# EAGLE design T2M_4_0 (EAGLE 9.5.2)

## Sheet 1 of 2
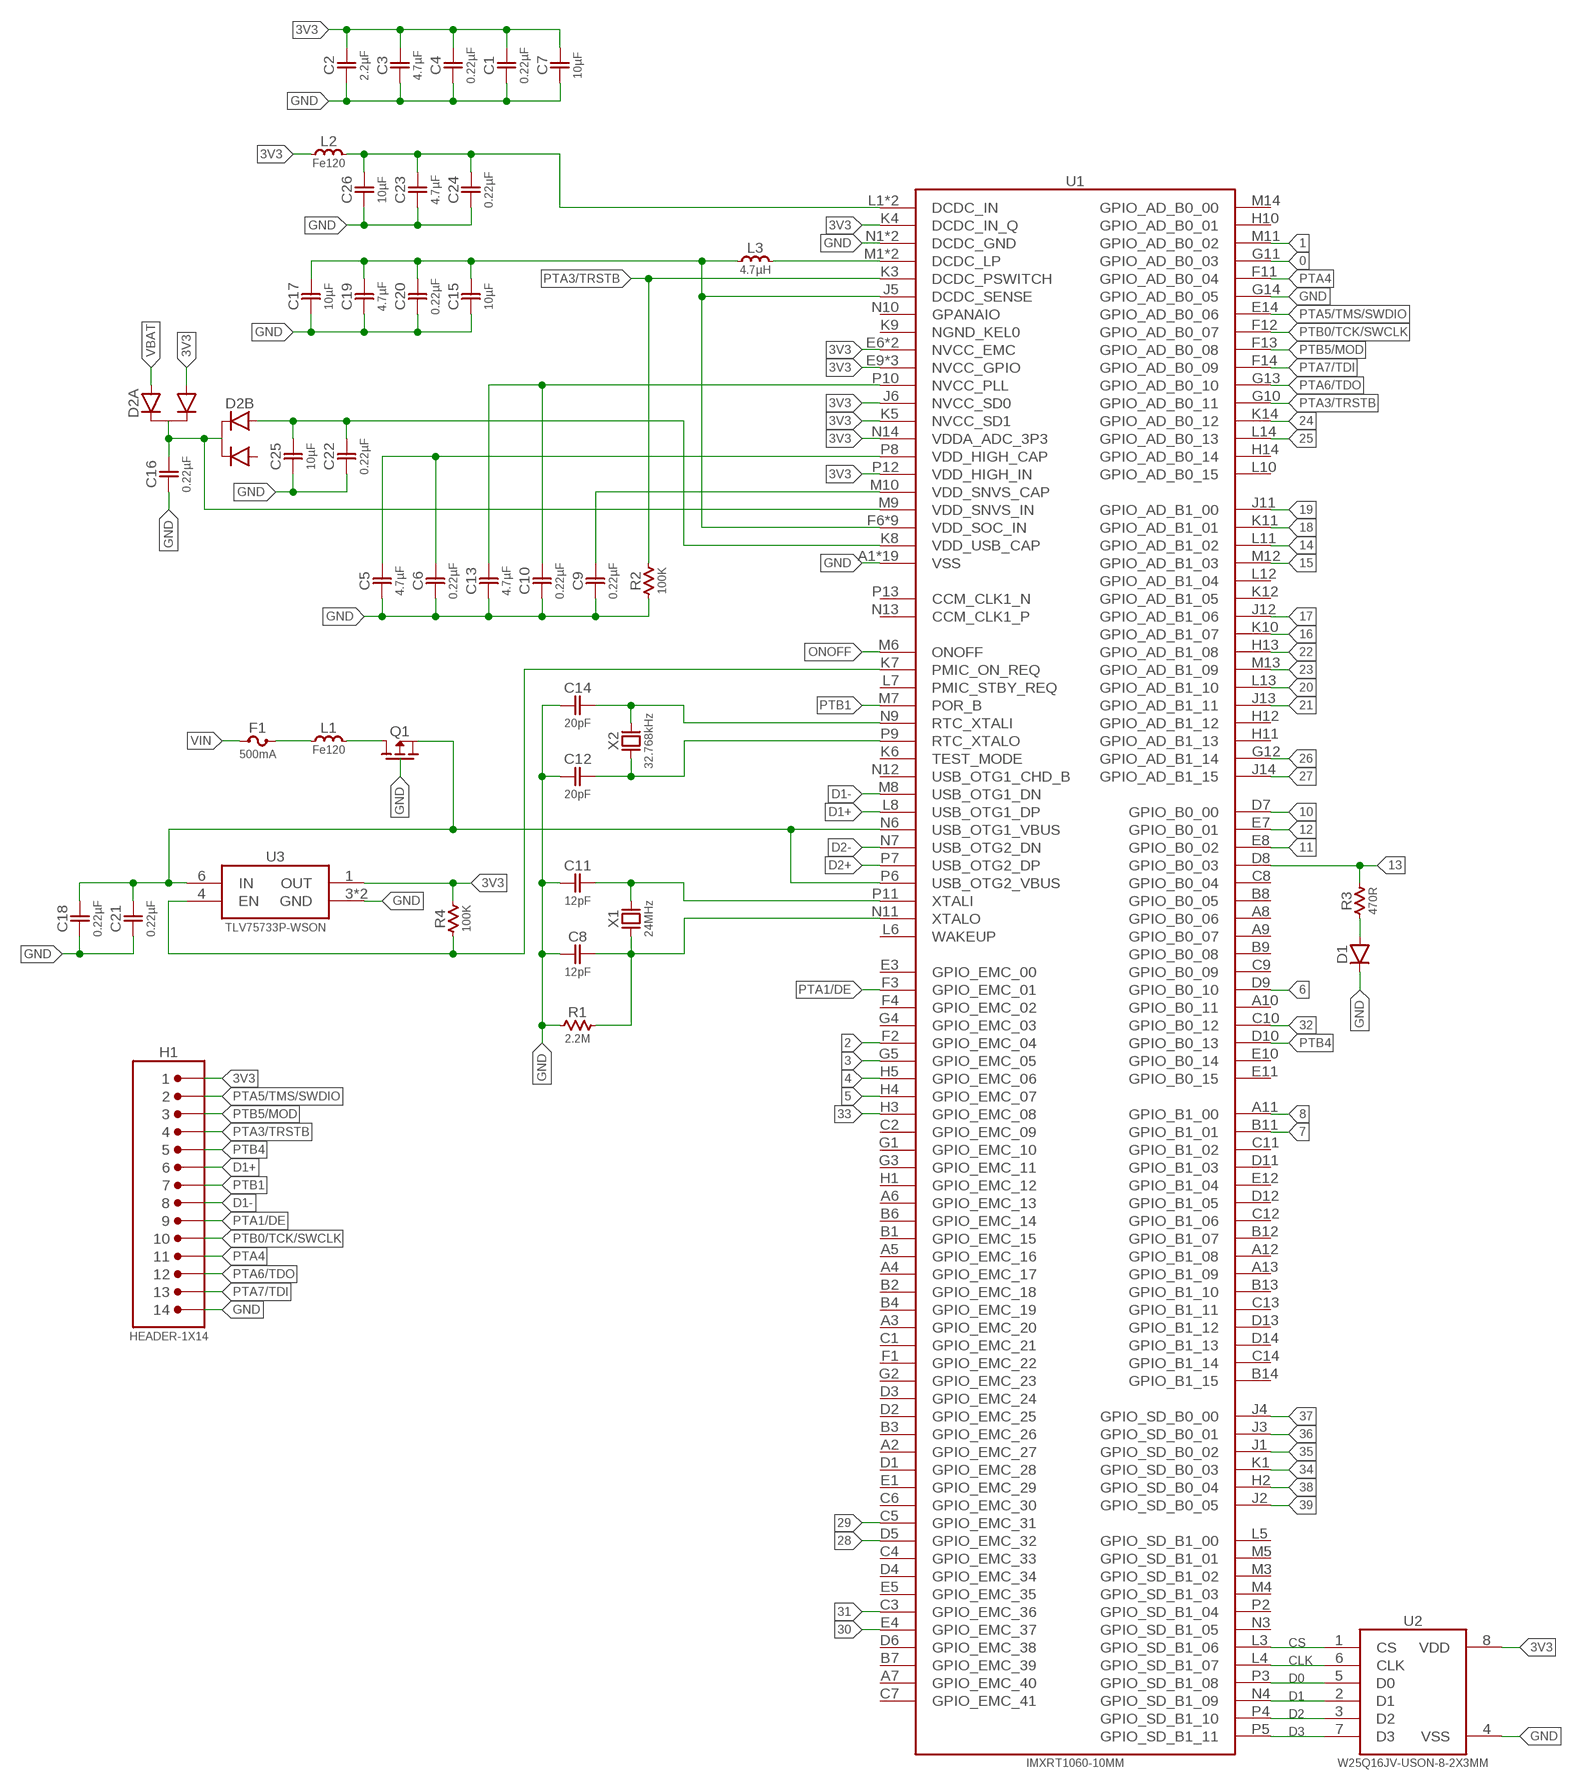
[diagram p0: schematic, sheet 1]

### Parts
C1  0.22µF  CAP-NP-0402  [0402-NP]
C2  2.2µF  CAP-NP-0402  [0402-NP]
C3  4.7µF  CAP-NP-0402  [0402-NP]
C4  0.22µF  CAP-NP-0402  [0402-NP]
C5  4.7µF  CAP-NP-0402  [0402-NP]
C6  0.22µF  CAP-NP-0402  [0402-NP]
C7  10µF  CAP-NP-0603  [0603-NP]
C8  12pF  CAP-NP-0402  [0402-NP]
C9  0.22µF  CAP-NP-0402  [0402-NP]
C10  0.22µF  CAP-NP-0402  [0402-NP]
C11  12pF  CAP-NP-0402  [0402-NP]
C12  20pF  CAP-NP-0402  [0402-NP]
C13  4.7µF  CAP-NP-0402  [0402-NP]
C14  20pF  CAP-NP-0402  [0402-NP]
C15  10µF  CAP-NP-0603  [0603-NP]
C16  0.22µF  CAP-NP-0402  [0402-NP]
C17  10µF  CAP-NP-0603  [0603-NP]
C18  0.22µF  CAP-NP-0402  [0402-NP]
C19  4.7µF  CAP-NP-0402  [0402-NP]
C20  0.22µF  CAP-NP-0402  [0402-NP]
C21  0.22µF  CAP-NP-0402  [0402-NP]
C22  0.22µF  CAP-NP-0402  [0402-NP]
C23  4.7µF  CAP-NP-0402  [0402-NP]
C24  0.22µF  CAP-NP-0402  [0402-NP]
C25  10µF  CAP-NP-0603  [0603-NP]
C26  10µF  CAP-NP-0603  [0603-NP]
D1  DIODE-0402  [0402-P]
D2  BAT54C-2-SOT-666  [SOT-666]
F1  500mA  FUSE-0603  [0603-NP]
H1  HEADER-1X14  [2X7-1.27MM]
L1  Fe120  INDUCTOR-0402  [0402-NP]
L2  Fe120  INDUCTOR-0402  [0402-NP]
L3  4.7µH  INDUCTOR-0603  [0603-NP]
Q1  MOSFET-P  [SOT-23]
R1  2.2M  RESISTOR-0402  [0402-NP]
R2  100K  RESISTOR-0402  [0402-NP]
R3  470R  RESISTOR-0402  [0402-NP]
R4  100K  RESISTOR-0402  [0402-NP]
U1  IMXRT1060-10MM  [BGA-196-10MM]
U2  W25Q16JV-USON-8-2X3MM  [USON-8-2X3MM]
U3  TLV75733P-WSON  [WSON-6]
X1  24MHz  CRYSTAL-2X1.6MM  [CRYSTAL-2X1.6MM]
X2  32.768kHz  CRYSTAL-2X1.2MM  [CRYSTAL-2X1.2MM]

### Nets
0: U1.G11(GPIO_AD_B0_03) ; also sheet 2
1: U1.M11(GPIO_AD_B0_02) ; also sheet 2
2: U1.F2(GPIO_EMC_04) ; also sheet 2
3: U1.G5(GPIO_EMC_05) ; also sheet 2
3V3: C1.2 C2.2 C3.2 C4.2 C7.2 D2.2(A:A2) H1.1 L2.1 R4.2 U1.E6(NVCC_EMC) U1.E9(NVCC_GPIO) U1.F5(NVCC_EMC) U1.F10(NVCC_GPIO) U1.J6(NVCC_SD0) U1.J10(NVCC_GPIO) U1.K4(DCDC_IN_Q) U1.K5(NVCC_SD1) U1.N14(VDDA_ADC_3P3) U1.P12(VDD_HIGH_IN) U2.8(VDD) U3.1(OUT) ; also sheet 2
4: U1.H5(GPIO_EMC_06) ; also sheet 2
5: U1.H4(GPIO_EMC_07) ; also sheet 2
6: U1.D9(GPIO_B0_10) ; also sheet 2
7: U1.B11(GPIO_B1_01) ; also sheet 2
8: U1.A11(GPIO_B1_00) ; also sheet 2
10: U1.D7(GPIO_B0_00) ; also sheet 2
11: U1.E8(GPIO_B0_02) ; also sheet 2
12: U1.E7(GPIO_B0_01) ; also sheet 2
13: R3.2 U1.D8(GPIO_B0_03) ; also sheet 2
14: U1.L11(GPIO_AD_B1_02) ; also sheet 2
15: U1.M12(GPIO_AD_B1_03) ; also sheet 2
16: U1.K10(GPIO_AD_B1_07) ; also sheet 2
17: U1.J12(GPIO_AD_B1_06) ; also sheet 2
18: U1.K11(GPIO_AD_B1_01) ; also sheet 2
19: U1.J11(GPIO_AD_B1_00) ; also sheet 2
20: U1.L13(GPIO_AD_B1_10) ; also sheet 2
21: U1.J13(GPIO_AD_B1_11) ; also sheet 2
22: U1.H13(GPIO_AD_B1_08) ; also sheet 2
23: U1.M13(GPIO_AD_B1_09) ; also sheet 2
24: U1.K14(GPIO_AD_B0_12) ; also sheet 2
25: U1.L14(GPIO_AD_B0_13) ; also sheet 2
26: U1.G12(GPIO_AD_B1_14) ; also sheet 2
27: U1.J14(GPIO_AD_B1_15) ; also sheet 2
28: U1.D5(GPIO_EMC_32) ; also sheet 2
29: U1.C5(GPIO_EMC_31) ; also sheet 2
30: U1.E4(GPIO_EMC_37) ; also sheet 2
31: U1.C3(GPIO_EMC_36) ; also sheet 2
32: U1.C10(GPIO_B0_12) ; also sheet 2
33: U1.H3(GPIO_EMC_08) ; also sheet 2
34: U1.K1(GPIO_SD_B0_03) ; also sheet 2
35: U1.J1(GPIO_SD_B0_02) ; also sheet 2
36: U1.J3(GPIO_SD_B0_01) ; also sheet 2
37: U1.J4(GPIO_SD_B0_00) ; also sheet 2
38: U1.H2(GPIO_SD_B0_04) ; also sheet 2
39: U1.J2(GPIO_SD_B0_05) ; also sheet 2
CLK: U1.L4(GPIO_SD_B1_07) U2.6(CLK)
CS: U1.L3(GPIO_SD_B1_06) U2.1(CS)
D0: U1.P3(GPIO_SD_B1_08) U2.5(D0)
D1: U1.N4(GPIO_SD_B1_09) U2.2(D1)
D1+: H1.6 U1.L8(USB_OTG1_DP) ; also sheet 2
D1-: H1.8 U1.M8(USB_OTG1_DN) ; also sheet 2
D2: U1.P4(GPIO_SD_B1_10) U2.3(D2)
D2+: U1.P7(USB_OTG2_DP) ; also sheet 2
D2-: U1.N7(USB_OTG2_DN) ; also sheet 2
D3: U1.P5(GPIO_SD_B1_11) U2.7(D3)
GND: C1.1 C2.1 C3.1 C4.1 C5.1 C6.1 C7.1 C8.1 C9.1 C10.1 C11.1 C12.1 C13.1 C14.1 C15.1 C16.1 C17.1 C18.1 C19.1 C20.1 C21.1 C22.1 C23.1 C24.1 C25.1 C26.1 D1.C H1.14 Q1.1(G) R1.1 R2.1 U1.A1(VSS) U1.A14(VSS) U1.B5(VSS) U1.B10(VSS) U1.E2(VSS) U1.E13(VSS) U1.G7(VSS) U1.G8(VSS) U1.G14(GPIO_AD_B0_05) U1.H7(VSS) U1.H8(VSS) U1.J7(VSS) U1.J8(VSS) U1.K2(VSS) U1.K13(VSS) U1.L9(VSS) U1.N1(DCDC_GND) U1.N2(DCDC_GND) U1.N5(VSS) U1.N8(VSS) U1.P1(VSS) U1.P14(VSS) U2.4(VSS) U3.3(GND) U3.7(GND) ; also sheet 2
N$1: C11.2 U1.P11(XTALI) X1.3
N$2: C8.2 R1.2 U1.N11(XTALO) X1.1
N$3: C14.2 U1.N9(RTC_XTALI) X2.2
N$4: C12.2 U1.P9(RTC_XTALO) X2.1
N$5: D1.A R3.1
N$6: C18.2 C21.2 Q1.2(S) U1.N6(USB_OTG1_VBUS) U1.P6(USB_OTG2_VBUS) U3.6(IN)
N$7: R4.1 U1.K7(PMIC_ON_REQ) U3.4(EN)
N$8: C22.2 C25.2 D2.4(B:A1) U1.K8(VDD_USB_CAP)
N$10: L3.2 U1.M1(DCDC_LP) U1.M2(DCDC_LP)
N$11: C23.2 C24.2 C26.2 L2.2 U1.L1(DCDC_IN) U1.L2(DCDC_IN)
N$12: C15.2 C17.2 C19.2 C20.2 L3.1 U1.F6(VDD_SOC_IN) U1.F7(VDD_SOC_IN) U1.F8(VDD_SOC_IN) U1.F9(VDD_SOC_IN) U1.G6(VDD_SOC_IN) U1.G9(VDD_SOC_IN) U1.H6(VDD_SOC_IN) U1.H9(VDD_SOC_IN) U1.J5(DCDC_SENSE) U1.J9(VDD_SOC_IN)
N$14: C16.2 D2.3(B:CC) D2.6(A:CC) U1.M9(VDD_SNVS_IN)
N$15: L1.2 Q1.3(D)
N$16: F1.2 L1.1
N$32: C5.2 C6.2 U1.P8(VDD_HIGH_CAP)
N$33: C10.2 C13.2 U1.P10(NVCC_PLL)
N$34: C9.2 U1.M10(VDD_SNVS_CAP)
ONOFF: U1.M6(ONOFF) ; also sheet 2
PTA1/DE: H1.9 U1.F3(GPIO_EMC_01) ; also sheet 2
PTA3/TRSTB: H1.4 R2.2 U1.G10(GPIO_AD_B0_11) U1.K3(DCDC_PSWITCH) ; also sheet 2
PTA4: H1.11 U1.F11(GPIO_AD_B0_04) ; also sheet 2
PTA5/TMS/SWDIO: H1.2 U1.E14(GPIO_AD_B0_06) ; also sheet 2
PTA6/TDO: H1.12 U1.G13(GPIO_AD_B0_10) ; also sheet 2
PTA7/TDI: H1.13 U1.F14(GPIO_AD_B0_09) ; also sheet 2
PTB0/TCK/SWCLK: H1.10 U1.F12(GPIO_AD_B0_07) ; also sheet 2
PTB1: H1.7 U1.M7(POR_B) ; also sheet 2
PTB4: H1.5 U1.D10(GPIO_B0_13) ; also sheet 2
PTB5/MOD: H1.3 U1.F13(GPIO_AD_B0_08) ; also sheet 2
VBAT: D2.1(A:A1) ; also sheet 2
VIN: F1.1 ; also sheet 2
Unconnected: D2.5(B:A2) U1.A2(GPIO_EMC_27) U1.A3(GPIO_EMC_20) U1.A4(GPIO_EMC_17) U1.A5(GPIO_EMC_16) U1.A6(GPIO_EMC_13) U1.A7(GPIO_EMC_40) U1.A8(GPIO_B0_06) U1.A9(GPIO_B0_07) U1.A10(GPIO_B0_11) U1.A12(GPIO_B1_08) U1.A13(GPIO_B1_09) U1.B1(GPIO_EMC_15) U1.B2(GPIO_EMC_18) U1.B3(GPIO_EMC_26) U1.B4(GPIO_EMC_19) U1.B6(GPIO_EMC_14) U1.B7(GPIO_EMC_39) U1.B8(GPIO_B0_05) U1.B9(GPIO_B0_08) U1.B12(GPIO_B1_07) U1.B13(GPIO_B1_10) U1.B14(GPIO_B1_15) U1.C1(GPIO_EMC_21) U1.C2(GPIO_EMC_09) U1.C4(GPIO_EMC_33) U1.C6(GPIO_EMC_30) U1.C7(GPIO_EMC_41) U1.C8(GPIO_B0_04) U1.C9(GPIO_B0_09) U1.C11(GPIO_B1_02) U1.C12(GPIO_B1_06) U1.C13(GPIO_B1_11) U1.C14(GPIO_B1_14) U1.D1(GPIO_EMC_28) U1.D2(GPIO_EMC_25) U1.D3(GPIO_EMC_24) U1.D4(GPIO_EMC_34) U1.D6(GPIO_EMC_38) U1.D11(GPIO_B1_03) U1.D12(GPIO_B1_05) U1.D13(GPIO_B1_12) U1.D14(GPIO_B1_13) U1.E1(GPIO_EMC_29) U1.E3(GPIO_EMC_00) U1.E5(GPIO_EMC_35) U1.E10(GPIO_B0_14) U1.E11(GPIO_B0_15) U1.E12(GPIO_B1_04) U1.F1(GPIO_EMC_22) U1.F4(GPIO_EMC_02) U1.G1(GPIO_EMC_10) U1.G2(GPIO_EMC_23) U1.G3(GPIO_EMC_11) U1.G4(GPIO_EMC_03) U1.H1(GPIO_EMC_12) U1.H10(GPIO_AD_B0_01) U1.H11(GPIO_AD_B1_13) U1.H12(GPIO_AD_B1_12) U1.H14(GPIO_AD_B0_14) U1.K6(TEST_MODE) U1.K9(NGND_KEL0) U1.K12(GPIO_AD_B1_05) U1.L5(GPIO_SD_B1_00) U1.L6(WAKEUP) U1.L7(PMIC_STBY_REQ) U1.L10(GPIO_AD_B0_15) U1.L12(GPIO_AD_B1_04) U1.M3(GPIO_SD_B1_02) U1.M4(GPIO_SD_B1_03) U1.M5(GPIO_SD_B1_01) U1.M14(GPIO_AD_B0_00) U1.N3(GPIO_SD_B1_05) U1.N10(GPANAIO) U1.N12(USB_OTG1_CHD_B) U1.N13(CCM_CLK1_P) U1.P2(GPIO_SD_B1_04) U1.P13(CCM_CLK1_N)

## Sheet 2 of 2
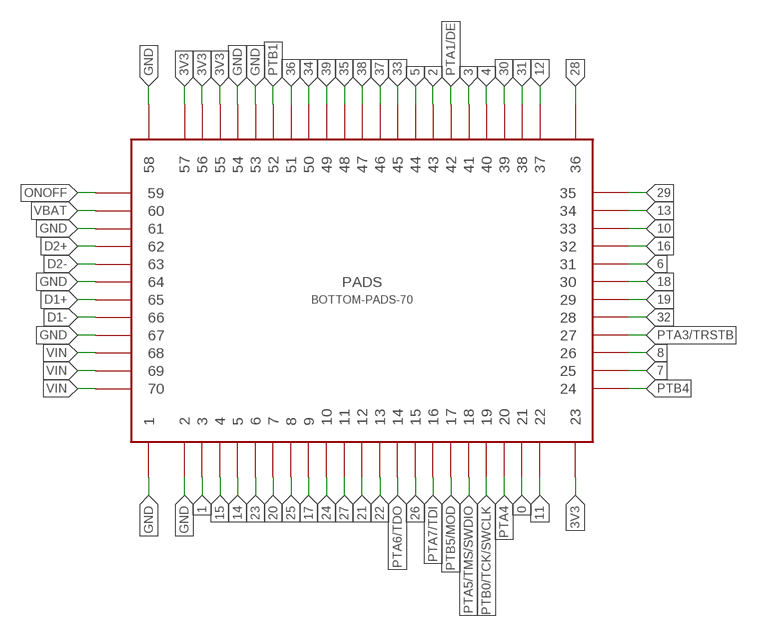
[diagram p1: schematic, sheet 2]

### Parts
PADS  BOTTOM-PADS-70  [BOTTOM-PADS-70]

### Nets
0: PADS.21 ; also sheet 1
1: PADS.3 ; also sheet 1
2: PADS.43 ; also sheet 1
3: PADS.41 ; also sheet 1
3V3: PADS.23 PADS.55 PADS.56 PADS.57 ; also sheet 1
4: PADS.40 ; also sheet 1
5: PADS.44 ; also sheet 1
6: PADS.31 ; also sheet 1
7: PADS.25 ; also sheet 1
8: PADS.26 ; also sheet 1
10: PADS.33 ; also sheet 1
11: PADS.22 ; also sheet 1
12: PADS.37 ; also sheet 1
13: PADS.34 ; also sheet 1
14: PADS.5 ; also sheet 1
15: PADS.4 ; also sheet 1
16: PADS.32 ; also sheet 1
17: PADS.9 ; also sheet 1
18: PADS.30 ; also sheet 1
19: PADS.29 ; also sheet 1
20: PADS.7 ; also sheet 1
21: PADS.12 ; also sheet 1
22: PADS.13 ; also sheet 1
23: PADS.6 ; also sheet 1
24: PADS.10 ; also sheet 1
25: PADS.8 ; also sheet 1
26: PADS.15 ; also sheet 1
27: PADS.11 ; also sheet 1
28: PADS.36 ; also sheet 1
29: PADS.35 ; also sheet 1
30: PADS.39 ; also sheet 1
31: PADS.38 ; also sheet 1
32: PADS.28 ; also sheet 1
33: PADS.45 ; also sheet 1
34: PADS.50 ; also sheet 1
35: PADS.48 ; also sheet 1
36: PADS.51 ; also sheet 1
37: PADS.46 ; also sheet 1
38: PADS.47 ; also sheet 1
39: PADS.49 ; also sheet 1
D1+: PADS.65 ; also sheet 1
D1-: PADS.66 ; also sheet 1
D2+: PADS.62 ; also sheet 1
D2-: PADS.63 ; also sheet 1
GND: PADS.1 PADS.2 PADS.53 PADS.54 PADS.58 PADS.61 PADS.64 PADS.67 ; also sheet 1
ONOFF: PADS.59 ; also sheet 1
PTA1/DE: PADS.42 ; also sheet 1
PTA3/TRSTB: PADS.27 ; also sheet 1
PTA4: PADS.20 ; also sheet 1
PTA5/TMS/SWDIO: PADS.18 ; also sheet 1
PTA6/TDO: PADS.14 ; also sheet 1
PTA7/TDI: PADS.16 ; also sheet 1
PTB0/TCK/SWCLK: PADS.19 ; also sheet 1
PTB1: PADS.52 ; also sheet 1
PTB4: PADS.24 ; also sheet 1
PTB5/MOD: PADS.17 ; also sheet 1
VBAT: PADS.60 ; also sheet 1
VIN: PADS.68 PADS.69 PADS.70 ; also sheet 1

## Library data of the parts
C1-C26 = T2M_4_0:CAP-NP
D1 = T2M_4_0:DIODE
D2 = T2M_4_0:BAT54C-2
F1 = T2M_4_0:FUSE
H1 = T2M_4_0:HEADER-1X14
L1-L3 = T2M_4_0:INDUCTOR
PADS = T2M_4_0:BOTTOM-PADS-70
Q1 = T2M_4_0:MOSFET-P
R1-R4 = T2M_4_0:RESISTOR
U1 = T2M_4_0:IMXRT1060
U2 = T2M_4_0:W25Q16JV
U3 = T2M_4_0:TLV75733P
X1 X2 = T2M_4_0:CRYSTAL

## Board
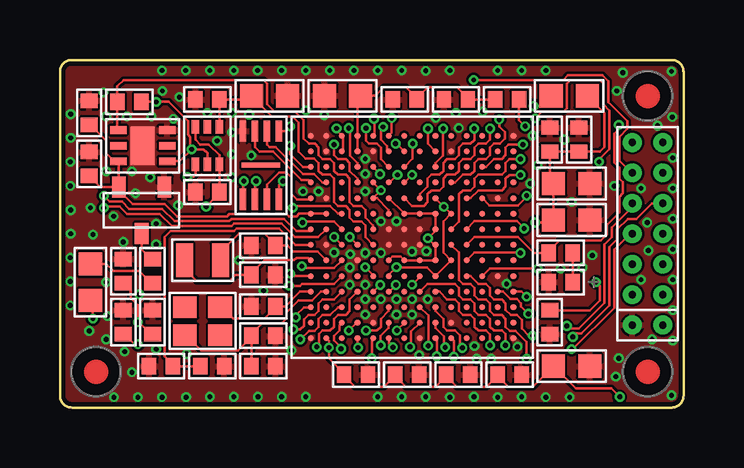
[diagram p2: board, top side]
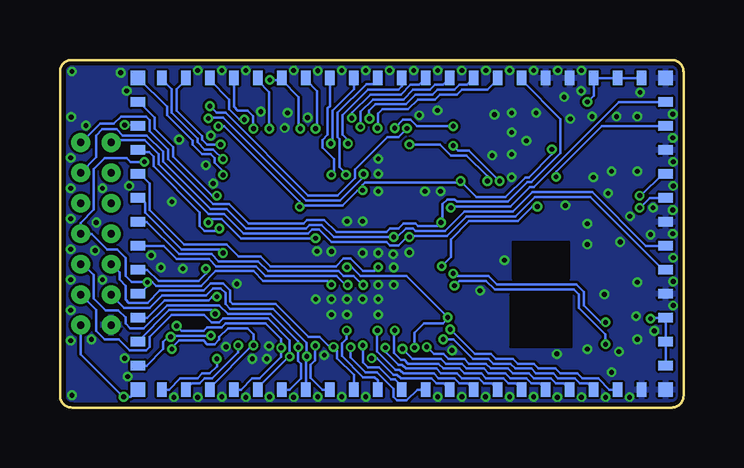
[diagram p3: board, bottom side, seen from below]

Size 26 x 14.5 mm. Coordinates in mm from the lower left corner, seen from the top.
Copper layers (1*16): Top 0.035mm / dielectric 0.2mm / Bottom 0.035mm
Design rules "default *": minimum track width 4mil, minimum drill 0.2mm, track to track 4mil, track to pad 4mil, pad to pad 4mil, via to via 4mil, smd to smd 2mil, copper to edge 7mil, drill to drill 7mil, minimum pad ring 4mil, minimum via ring 4mil, stop-mask expansion 0mil, vias tented up to drill 0.2mm, thermal gap 4mil

### Footprints (pad centres in the part's own frame; a part is rotated, then mirrored left to right if it is on the bottom)
0402-NP = smd 0.6 x 0.7: 1 -0.5,0; 2 0.5,0
0603-NP = smd 0.96 x 0.97: 1 -0.755,0; 2 0.755,0
0402-P = smd 0.6 x 0.7: A -0.5,0; C 0.5,0
SOT-666 = smd 0.56 x 0.32: 1 -0.785,0.5; 2 -0.785,0; 3 -0.785,-0.5; 4 0.785,-0.5; 5 0.785,0; 6 0.785,0.5
2X7-1.27MM = drill 0.305 pad 0.787: 1 -3.81,-0.635; 2 -2.54,-0.635; 3 -1.27,-0.635; 4 0,-0.635; 5 1.27,-0.635; 6 2.54,-0.635; 7 3.81,-0.635; 8 3.81,0.635; 9 2.54,0.635; 10 1.27,0.635; 11 0,0.635; 12 -1.27,0.635; 13 -2.54,0.635; 14 -3.81,0.635
BOTTOM-PADS-70 = smd 0.6 x 0.6 bottom: 1 0.75,0.75; 23 22.75,0.75; 36 22.75,13.75; 58 0.75,13.75 | smd 0.4 x 0.6 bottom: 2 1.75,0.75; 3 2.75,0.75; 4 3.75,0.75; 5 4.75,0.75; 6 5.75,0.75; 7 6.75,0.75; 8 7.75,0.75; 9 8.75,0.75; 10 9.75,0.75; 11 10.75,0.75; 12 11.75,0.75; 13 12.75,0.75; 14 13.75,0.75; 15 14.75,0.75; 16 15.75,0.75; 17 16.75,0.75; 18 17.75,0.75; 19 18.75,0.75; 20 19.75,0.75; 21 20.75,0.75; 22 21.75,0.75; 37 21.75,13.75; 38 20.75,13.75; 39 19.75,13.75; 40 18.75,13.75; 41 17.75,13.75; 42 16.75,13.75; 43 15.75,13.75; 44 14.75,13.75; 45 13.75,13.75; 46 12.75,13.75; 47 11.75,13.75; 48 10.75,13.75; 49 9.75,13.75; 50 8.75,13.75; 51 7.75,13.75; 52 6.75,13.75; 53 5.75,13.75; 54 4.75,13.75; 55 3.75,13.75; 56 2.75,13.75; 57 1.75,13.75 | smd 0.6 x 0.4 bottom: 24 22.75,1.75; 25 22.75,2.75; 26 22.75,3.75; 27 22.75,4.75; 28 22.75,5.75; 29 22.75,6.75; 30 22.75,7.75; 31 22.75,8.75; 32 22.75,9.75; 33 22.75,10.75; 34 22.75,11.75; 35 22.75,12.75; 59 0.75,12.75; 60 0.75,11.75; 61 0.75,10.75; 62 0.75,9.75; 63 0.75,8.75; 64 0.75,7.75; 65 0.75,6.75; 66 0.75,5.75; 67 0.75,4.75; 68 0.75,3.75; 69 0.75,2.75; 70 0.75,1.75
SOT-23 = smd 0.88 x 0.569: 1 -0.975,0.95; 2 -0.975,-0.95; 3 0.975,0
BGA-196-10MM = smd 0.25 x 0.25: A1 -4.225,4.225; A2 -3.575,4.225; A3 -2.925,4.225; A4 -2.275,4.225; A5 -1.625,4.225; A6 -0.975,4.225; A7 -0.325,4.225; A8 0.325,4.225; A9 0.975,4.225; A10 1.625,4.225; A11 2.275,4.225; A12 2.925,4.225; A13 3.575,4.225; A14 4.225,4.225; B1 -4.225,3.575; B2 -3.575,3.575; B3 -2.925,3.575; B4 -2.275,3.575; B5 -1.625,3.575; B6 -0.975,3.575; B7 -0.325,3.575; B8 0.325,3.575; B9 0.975,3.575; B10 1.625,3.575; B11 2.275,3.575; B12 2.925,3.575; B13 3.575,3.575; B14 4.225,3.575; C1 -4.225,2.925; C2 -3.575,2.925; C3 -2.925,2.925; C4 -2.275,2.925; C5 -1.625,2.925; C6 -0.975,2.925; C7 -0.325,2.925; C8 0.325,2.925; C9 0.975,2.925; C10 1.625,2.925; C11 2.275,2.925; C12 2.925,2.925; C13 3.575,2.925; C14 4.225,2.925; D1 -4.225,2.275; D2 -3.575,2.275; D3 -2.925,2.275; D4 -2.275,2.275; D5 -1.625,2.275; D6 -0.975,2.275; D7 -0.325,2.275; D8 0.325,2.275; D9 0.975,2.275; D10 1.625,2.275; D11 2.275,2.275; D12 2.925,2.275; D13 3.575,2.275; D14 4.225,2.275; E1 -4.225,1.625; E2 -3.575,1.625; E3 -2.925,1.625; E4 -2.275,1.625; E5 -1.625,1.625; E6 -0.975,1.625; E7 -0.325,1.625; E8 0.325,1.625; E9 0.975,1.625; E10 1.625,1.625; E11 2.275,1.625; E12 2.925,1.625; E13 3.575,1.625; E14 4.225,1.625; F1 -4.225,0.975; F2 -3.575,0.975; F3 -2.925,0.975; F4 -2.275,0.975; F5 -1.625,0.975; F6 -0.975,0.975; F7 -0.325,0.975; F8 0.325,0.975; F9 0.975,0.975; F10 1.625,0.975; F11 2.275,0.975; F12 2.925,0.975; F13 3.575,0.975; F14 4.225,0.975; G1 -4.225,0.325; G2 -3.575,0.325; G3 -2.925,0.325; G4 -2.275,0.325; G5 -1.625,0.325; G6 -0.975,0.325; G7 -0.325,0.325; G8 0.325,0.325; G9 0.975,0.325; G10 1.625,0.325; G11 2.275,0.325; G12 2.925,0.325; G13 3.575,0.325; G14 4.225,0.325; H1 -4.225,-0.325; H2 -3.575,-0.325; H3 -2.925,-0.325; H4 -2.275,-0.325; H5 -1.625,-0.325; H6 -0.975,-0.325; H7 -0.325,-0.325; H8 0.325,-0.325; H9 0.975,-0.325; H10 1.625,-0.325; H11 2.275,-0.325; H12 2.925,-0.325; H13 3.575,-0.325; H14 4.225,-0.325; J1 -4.225,-0.975; J2 -3.575,-0.975; J3 -2.925,-0.975; J4 -2.275,-0.975; J5 -1.625,-0.975; J6 -0.975,-0.975; J7 -0.325,-0.975; J8 0.325,-0.975; J9 0.975,-0.975; J10 1.625,-0.975; J11 2.275,-0.975; J12 2.925,-0.975; J13 3.575,-0.975; J14 4.225,-0.975; K1 -4.225,-1.625; K2 -3.575,-1.625; K3 -2.925,-1.625; K4 -2.275,-1.625; K5 -1.625,-1.625; K6 -0.975,-1.625; K7 -0.325,-1.625; K8 0.325,-1.625; K9 0.975,-1.625; K10 1.625,-1.625; K11 2.275,-1.625; K12 2.925,-1.625; K13 3.575,-1.625; K14 4.225,-1.625; L1 -4.225,-2.275; L2 -3.575,-2.275; L3 -2.925,-2.275; L4 -2.275,-2.275; L5 -1.625,-2.275; L6 -0.975,-2.275; L7 -0.325,-2.275; L8 0.325,-2.275; L9 0.975,-2.275; L10 1.625,-2.275; L11 2.275,-2.275; L12 2.925,-2.275; L13 3.575,-2.275; L14 4.225,-2.275; M1 -4.225,-2.925; M2 -3.575,-2.925; M3 -2.925,-2.925; M4 -2.275,-2.925; M5 -1.625,-2.925; M6 -0.975,-2.925; M7 -0.325,-2.925; M8 0.325,-2.925; M9 0.975,-2.925; M10 1.625,-2.925; M11 2.275,-2.925; M12 2.925,-2.925; M13 3.575,-2.925; M14 4.225,-2.925; N1 -4.225,-3.575; N2 -3.575,-3.575; N3 -2.925,-3.575; N4 -2.275,-3.575; N5 -1.625,-3.575; N6 -0.975,-3.575; N7 -0.325,-3.575; N8 0.325,-3.575; N9 0.975,-3.575; N10 1.625,-3.575; N11 2.275,-3.575; N12 2.925,-3.575; N13 3.575,-3.575; N14 4.225,-3.575; P1 -4.225,-4.225; P2 -3.575,-4.225; P3 -2.925,-4.225; P4 -2.275,-4.225; P5 -1.625,-4.225; P6 -0.975,-4.225; P7 -0.325,-4.225; P8 0.325,-4.225; P9 0.975,-4.225; P10 1.625,-4.225; P11 2.275,-4.225; P12 2.925,-4.225; P13 3.575,-4.225; P14 4.225,-4.225
USON-8-2X3MM = smd 0.888 x 0.27: 1 -1.421,0.75; 2 -1.421,0.25; 3 -1.421,-0.25; 4 -1.421,-0.75; 5 1.421,-0.75; 6 1.421,-0.25; 7 1.421,0.25; 8 1.421,0.75 | smd 0.2 x 1.6: 9 0,0
WSON-6 = smd 0.688 x 0.32: 1 -1.021,0.65; 2 -1.021,0; 3 -1.021,-0.65; 4 1.021,-0.65; 5 1.021,0; 6 1.021,0.65 | smd 1 x 1.6: 7 0,0
CRYSTAL-2X1.6MM = smd 0.991 x 0.891: 1 -0.735,-0.585; 2 0.735,-0.585; 3 0.735,0.585; 4 -0.735,0.585
CRYSTAL-2X1.2MM = smd 0.7 x 1.4: 1 -0.75,0; 2 0.75,0

### Placement (x,y rotation side)
C1  12.34,1.37 180 top
C2  14.48,1.37 180 top
C3  16.61,1.37 180 top
C4  18.75,1.37 180 top
C5  4.22,1.73 0 top
C6  6.35,1.73 180 top
C7  21.34,1.73 180 top
C8  8.48,3 180 top
C9  2.64,3.56 270 top
C10  3.86,3.56 270 top
C11  8.48,4.22 0 top
C12  8.48,5.54 180 top
C13  2.64,5.69 270 top
C14  8.48,6.76 0 top
C15  21.34,7.82 180 top
C16  6.15,8.99 0 top
C17  21.34,9.35 180 top
C18  1.22,10.16 270 top
C19  20.42,11.18 270 top
C20  21.64,11.18 270 top
C21  1.22,12.29 270 top
C22  6.15,12.85 0 top
C23  14.38,12.85 0 top
C24  16.51,12.85 0 top
C25  8.74,13 180 top
C26  11.79,13 0 top
D1  20.88,5.23 180 top
D2  6.15,10.92 90 top
F1  1.27,5.23 90 top
FID1  [FIDUCIAL]  1.5,1.5 0 top
FID2  [FIDUCIAL]  24.5,1.5 0 top
FID3  [FIDUCIAL]  24.5,13 0 top
H1  24.5,7.25 90 top
L1  3.86,5.69 90 top
L2  18.64,12.85 180 top
L3  21.23,13 180 top
PADS  0,0 0 top
Q1  3.4,8.23 270 top
R1  8.48,1.73 180 top
R2  20.42,3.56 90 top
R3  20.88,6.45 180 top
R4  2.9,12.75 0 top
U1  14.68,7.11 270 top
U2  8.38,10.11 270 top
U3  3.45,10.92 180 top
X1  5.94,3.61 0 top
X2  5.94,6.15 0 top

### Tracks (layer width: path | path; a pad name or v marks a point on that pad's centre or on a via)
0  (via drill 0.2)
  Top 0.102: U1.G11 15.33,5.16 16.47,5.16 16.63,5 16.63,4.67 16.79,4.51 17.12,4.51 17.28,4.35 17.28,4.02 17.44,3.86 17.77,3.86 17.93,3.7 17.93,3.37 18.09,3.21 18.42,3.21 18.57,3.06 v18.57,2.59
  Bottom 0.102: v18.57,2.59 18.57,2.31 19.66,1.22 19.96,1.22 20.17,1.02 20.48,1.02 PADS.21
1  (via drill 0.2)
  Top 0.102: U1.M11 11.43,4.51 10.94,4.51 10.78,4.35 10.78,4.02 10.62,3.86 10.36,3.86 10.17,3.67 10.17,3.42 10.02,3.26 v9.73,3.26
  Bottom 0.102: v9.73,3.26 8.7,2.23 8.03,2.23 7.82,2.03 7.11,2.03 6.91,1.83 6.25,1.83 6.04,1.63 5.33,1.63 5.13,1.42 4.42,1.42 4.22,1.22 3.56,1.22 3.09,0.75 PADS.3
2  (via drill 0.2)
  Top 0.102: U1.F2 15.34,11 v15.34,11.63
  Bottom 0.102: v15.34,11.63 15.29,11.68 15.29,13.21 15.75,13.67 PADS.43
3  (via drill 0.2)
  Top 0.102: U1.G5 15.01,8.9 15.33,9.22 15.33,9.55 15.49,9.71 15.82,9.71 15.98,9.87 15.98,10.2 16.14,10.36 16.47,10.36 16.63,10.52 16.63,10.85 16.79,11.01 17.12,11.01 17.27,11.16 v17.27,11.63
  Bottom 0.102: v17.27,11.63 17.27,13.16 17.75,13.63 PADS.41
3V3  (via drill 0.2)
  Top 0.102: U1.J10 13.71,5.53 v14.03,5.85 15.29,5.85 U1.F10 U1.E9 15.98,6.46 15.98,7.76 U1.E6 16.29,8.09 v16.01,8.37 15.66,8.72 U1.F5 | U1.N14 11.21,2.78 v11.21,2.5 11.21,2.04 11.84,1.41 C1.2 11.84,1.31 12.29,0.86 13.51,0.86 13.98,1.33 C2.2 13.98,1.31 14.43,0.86 15.65,0.86 16.11,1.33 C3.2 16.11,1.31 16.56,0.86 17.78,0.86 18.25,1.33 C4.2 18.25,1.31 18.69,0.86 19.72,0.86 C7.2 21.51,0.8 22.99,0.8 v23.34,0.45 | U1.J6 13.71,8.25 13.22,8.74 U1.K5 v13.38,9.06 U1.K4 | U2.8 9.13,9.28 v9.3,9.45 | U1.P12 10.18,4.19 9.83,3.83 v9.83,3.76 | U3.1 4.99,10.27 v5.49,10.77 | v5.49,10.77 5.99,10.77 6.15,10.62 D2.2 | L2.1 19.14,11.98 v19.39,11.73 | v5.49,10.77 5.44,10.82 5.44,11.28 5.33,11.38 5.33,11.94 4.52,12.75 v4.01,12.75 R4.2
  Bottom 0.102: v11.21,2.5 11.21,3.11 10.82,3.5 10.03,3.5 9.83,3.71 v9.83,3.76 11.56,5.49 13.46,5.49 13.83,5.85 v14.03,5.85 | v19.39,11.73 19.15,11.73 16.01,8.59 v16.01,8.37 15.95,8.43 14.22,8.43 13.6,9.06 v13.38,9.06 13.38,9.28 13.27,9.38 9.36,9.38 v9.3,9.45 8.64,8.79 7.42,8.79 6.6,9.6 6.45,9.6 5.49,10.57 v5.49,10.77 | H1.1 25.14,2.22 23.36,0.45 v23.34,0.45 23.05,0.45 PADS.23 | PADS.57 PADS.56 PADS.55 3.75,13.01 v4.01,12.75
4  (via drill 0.2)
  Top 0.102: U1.H5 14.68,8.41 15.17,8.41 15.33,8.57 15.33,8.9 15.49,9.06 15.82,9.06 15.98,9.22 15.98,9.55 16.14,9.71 16.47,9.71 16.63,9.87 16.63,10.2 16.79,10.36 17.12,10.36 17.28,10.52 17.28,10.85 17.44,11.01 17.77,11.01 17.93,11.18 v17.93,11.63
  Bottom 0.102: v17.93,11.63 17.96,11.66 17.96,12.17 18.19,12.39 18.59,12.39 18.75,12.55 PADS.40
5  (via drill 0.2)
  Top 0.102: U1.H4 v14.68,9.71
  Bottom 0.102: v14.68,9.71 14.58,9.81 14.58,10.36 15.06,10.85 15.06,11.16 14.83,11.39 14.83,12.5 14.75,12.58 PADS.44
6  (via drill 0.2)
  Top 0.102: U1.D9 17.28,6.46 19.19,6.46 v19.2,6.45
  Bottom 0.102: v19.2,6.45 19.36,6.6 20.93,6.6 22.45,8.13 22.45,8.53 22.67,8.75 PADS.31
7  (via drill 0.2)
  Top 0.102: U1.B11 18.47,4.84 18.79,4.52 19.05,4.52 19.23,4.34 19.23,4.22 v19.53,3.91
  Bottom 0.102: v19.53,3.91 19.68,4.06 21.44,4.06 PADS.25
8  (via drill 0.2)
  Top 0.102: U1.A11 19.24,4.84 v19.46,4.62
  Bottom 0.102: PADS.26 22.36,3.75 21.64,4.47 19.81,4.47 19.66,4.62 v19.46,4.62
10  (via drill 0.2)
  Top 0.102: U1.D7 17.29,7.77 19.05,7.77 v19.36,7.47
  Bottom 0.102: v19.36,7.47 19.46,7.37 19.96,7.37 20.17,7.57 20.17,8.14 22.1,10.07 22.1,10.46 22.28,10.65 22.65,10.65 PADS.33
11  (via drill 0.2)
  Top 0.102: U1.E8 16.63,6.46 16.63,5.32 16.79,5.16 17.12,5.16 17.28,5 17.28,4.67 17.44,4.51 17.77,4.51 17.93,4.35 17.93,4.02 18.09,3.86 18.42,3.86 18.58,3.7 18.58,3.37 18.75,3.2 19,3.2 19.46,2.74 v19.46,2.03
  Bottom 0.102: v19.46,2.03 19.46,1.73 19.76,1.42 20.07,1.42 20.27,1.22 20.98,1.22 21.45,0.75 PADS.22
12  (via drill 0.2)
  Top 0.102: U1.E7 16.63,7.76 16.63,8.9 16.79,9.06 17.12,9.06 17.28,9.22 17.28,9.55 17.44,9.71 18.42,9.71 18.58,9.87 18.58,10.2 18.75,10.36 v19.2,10.36
  Bottom 0.102: v19.2,10.36 19.61,10.77 19.96,10.77 20.27,11.07 20.27,11.23 21.34,12.29 21.34,13.29 21.75,13.7 PADS.37
13  (via drill 0.2)
  Top 0.102: U1.D8 17.28,7.11 19.1,7.11 19.76,6.45 R3.2 20.38,6.51 20.83,6.96 22.55,6.96 22.81,7.21 22.81,7.62 23.32,8.13 23.32,8.79 23.47,8.94 23.47,9.4 23.32,9.55 23.32,10.01 23.11,10.21 23.11,11.43 23.3,11.62 v23.3,11.79
  Bottom 0.102: PADS.34 22.79,11.79 v23.3,11.79
14  (via drill 0.2)
  Top 0.102: U1.L11 12.08,4.51 12.08,4.02 11.92,3.86 11.59,3.86 11.43,3.7 11.43,3.37 11.27,3.21 10.94,3.21 10.81,3.08 10.81,2.63 v10.71,2.53
  Bottom 0.102: v10.71,2.53 10.41,2.23 10.01,2.23 9.8,2.03 9.14,2.03 8.94,1.83 8.23,1.83 8.03,1.63 7.32,1.63 7.11,1.42 6.45,1.42 6.25,1.22 5.54,1.22 5.32,1 5,1 PADS.5
15  (via drill 0.2)
  Top 0.102: U1.M12 11.59,4.19 11.27,3.86 10.94,3.86 10.78,3.7 10.78,3.37 10.61,3.2 10.38,3.2 v10.02,2.85
  Bottom 0.102: v10.02,2.85 9.6,2.85 8.79,2.03 8.13,2.03 7.92,1.83 7.21,1.83 7.01,1.63 6.35,1.63 6.15,1.42 5.44,1.42 5.23,1.22 4.52,1.22 4.32,1.02 4.02,1.02 PADS.4
16  (via drill 0.2)
  Top 0.102: U1.K10 13.06,5.53 v12.73,5.85
  Bottom 0.102: v12.73,5.85 12.89,5.69 13.36,5.69 13.88,6.21 14.17,6.21 14.49,5.89 17.22,5.89 17.63,6.3 18.54,6.3 19.05,6.81 20.83,6.81 22.25,8.23 22.25,9.35 22.65,9.75 PADS.32
17  (via drill 0.2)
  Top 0.102: U1.J12 13.71,4.02 13.38,3.7 13.38,3.37 13.22,3.21 v12.76,3.21
  Bottom 0.102: v12.76,3.21 12.79,3.19 12.79,2.35 12.01,1.57 11.84,1.57 11.68,1.42 10.41,1.42 10.21,1.22 9.55,1.22 9.34,1 9,1 PADS.9
18  (via drill 0.2)
  Top 0.102: U1.K11 13.08,4.84 v13.36,5.11
  Bottom 0.102: v13.36,5.11 13.39,5.11 13.77,5.49 14.17,5.49 14.38,5.69 17.32,5.69 17.73,6.1 19.38,6.1 19.68,6.4 21.03,6.4 22.38,7.75 PADS.30
19  (via drill 0.2)
  Top 0.102: v14.01,5.11 13.73,4.84 U1.J11
  Bottom 0.102: v14.01,5.11 14.1,5.11 14.48,5.49 17.42,5.49 17.83,5.89 19.48,5.89 19.79,6.2 21.13,6.2 21.68,6.75 PADS.29
20  (via drill 0.2)
  Top 0.102: U1.L13 12.36,3.54 v12.04,3.21
  Bottom 0.102: v12.04,3.21 12.08,3.17 12.08,2.27 11.79,1.98 11.63,1.98 11.48,1.83 10.21,1.83 10.01,1.63 9.35,1.63 9.14,1.42 8.43,1.42 8.23,1.22 7.52,1.22 7.3,1 7,1 PADS.7
21  (via drill 0.2)
  Top 0.102: U1.J13 13.71,3.32 13.37,2.99 v13.37,2.59
  Bottom 0.102: v13.37,2.59 13.36,2.58 13.36,1.88 13.16,1.68 12.7,1.68 12.19,1.17 12.04,1.17 11.75,0.88 PADS.12
22  (via drill 0.2)
  Top 0.102: U1.H13 14.07,3.25 14.07,3.21 v14.05,3.21
  Bottom 0.102: PADS.13 12.75,1.14 12.88,1.27 13.36,1.27 14.24,2.15 14.24,2.67 14.05,2.86 v14.05,3.21
23  (via drill 0.2)
  Top 0.102: U1.M13 11.65,3.44 11.65,3.22 11.43,3 11.43,2.79 11.72,2.5 v11.72,2.45
  Bottom 0.102: PADS.6 6,1 6.34,1 6.55,1.22 7.21,1.22 7.42,1.42 8.13,1.42 8.33,1.63 9.04,1.63 9.25,1.83 9.91,1.83 10.11,2.03 11.3,2.03 v11.72,2.45
24  (via drill 0.2)
  Top 0.102: U1.K14 13.01,2.84 v13.01,2.06
  Bottom 0.102: v13.01,2.06 12.79,2.06 12.1,1.37 11.94,1.37 11.79,1.22 10.52,1.22 10.3,1 10,1 PADS.10
25  (via drill 0.2)
  Top 0.102: v12.43,2.5 12.41,2.53 U1.L14
  Bottom 0.102: v12.43,2.5 12.43,2.32 11.89,1.78 11.73,1.78 11.58,1.63 10.31,1.63 10.11,1.42 9.45,1.42 9.25,1.22 8.53,1.22 8.32,1 8,1 PADS.8
26  (via drill 0.2)
  Top 0.102: U1.G12 15.35,3.84 v15.35,2.58
  Bottom 0.102: PADS.15 15.05,0.75 15.54,1.24 15.54,1.78 15.35,1.97 v15.35,2.58
27  (via drill 0.2)
  Top 0.102: U1.J14 13.73,2.87 13.73,2.67 v13.88,2.52
  Bottom 0.102: v13.88,2.52 13.88,2.1 13.26,1.47 12.79,1.47 12.1,0.79 12.1,0.44 11.96,0.29 11.54,0.29 11.09,0.75 PADS.11
28  (via drill 0.2)
  Top 0.102: U1.D5 17.12,8.74 17.44,9.06 18.42,9.06 18.58,9.22 18.58,9.55 18.73,9.7 v19.2,9.7
  Bottom 0.102: PADS.36 22.73,13.75 21.54,12.56 21.54,12.19 20.47,11.12 20.47,10.97 20.07,10.57 19.71,10.57 19.56,10.41 19.56,10.21 19.2,9.86 v19.2,9.7
29  (via drill 0.2)
  Top 0.102: U1.C5 17.91,8.43 19.1,8.43 19.51,8.84 v19.46,8.84
  Bottom 0.102: v19.46,8.84 19.66,8.84 21.29,10.46 21.29,10.87 22.05,11.63 22.05,12.09 22.71,12.75 PADS.35
30  (via drill 0.2)
  Top 0.102: U1.E4 16.47,9.39 16.79,9.71 17.12,9.71 17.28,9.87 17.28,10.2 17.44,10.36 17.77,10.36 17.93,10.52 17.93,10.85 18.09,11.01 18.34,11.01 18.54,11.21 18.54,11.48 18.31,11.71 v18.31,12.01
  Bottom 0.102: v18.31,12.01 18.52,12.01 18.95,12.45 18.95,12.85 19.75,13.65 PADS.39
31  (via drill 0.2)
  Top 0.102: U1.C3 17.77,10.04 18.09,10.36 18.42,10.36 18.58,10.52 18.58,10.85 18.7,10.97 v19.3,10.97
  Bottom 0.102: v19.3,10.97 19.86,10.97 20.07,11.18 20.07,11.33 21.13,12.39 21.13,13.28 20.75,13.66 PADS.38
32  (via drill 0.2)
  Top 0.102: U1.C10 17.93,5.81 19.91,5.81 v19.91,5.79
  Bottom 0.102: v19.91,5.79 19.91,5.59 20.22,5.28 21.89,5.28 22.36,5.75 PADS.28
33  (via drill 0.2)
  Top 0.102: U1.H3 14.71,10.39 v14.71,11.01
  Bottom 0.102: v14.71,11.01 14.63,11.09 14.63,12.39 13.75,13.28 PADS.45
34  (via drill 0.2)
  Top 0.102: U1.K1 13.12,11.4 13.12,12.03 v13.09,12.05
  Bottom 0.102: v13.09,12.05 13.11,12.06 13.11,12.39 12.85,12.65 11.58,12.65 11.18,13.06 10.46,13.06 10.26,13.26 9.55,13.26 9.35,13.46 9.04,13.46 PADS.50
35  (via drill 0.2)
  Top 0.102: U1.J1 13.83,11.46 v13.83,12.08
  Bottom 0.102: PADS.48 11.04,13.46 11.38,13.46 11.79,13.06 13.06,13.06 13.82,12.29 13.82,12.09 v13.83,12.08
36  (via drill 0.2)
  Top 0.102: U1.J3 13.38,10.36 13.38,10.85 13.22,11.01 12.89,11.01 12.76,11.14 v12.76,11.66
  Bottom 0.102: v12.76,11.66 12.74,11.68 12.74,12.26 12.55,12.45 11.48,12.45 11.07,12.85 10.36,12.85 10.16,13.06 9.45,13.06 9.25,13.26 8.18,13.26 7.75,13.69 PADS.51
37  (via drill 0.2)
  Top 0.102: v14.07,9.71 13.74,9.39 U1.J4
  Bottom 0.102: v14.07,9.71 14.07,9.75 14.35,10.03 14.35,11.2 14.43,11.28 14.43,12.29 13.22,13.5 12.95,13.5 12.75,13.7 PADS.46
38  (via drill 0.2)
  Top 0.102: U1.H2 14.03,11.01 v13.99,11.01
  Bottom 0.102: PADS.47 11.75,13.4 11.89,13.26 13.16,13.26 14.22,12.19 14.22,11.38 13.99,11.15 v13.99,11.01
39  (via drill 0.2)
  Top 0.102: U1.J2 13.64,10.75 13.64,10.91 13.39,11.17 13.39,11.62 v13.47,11.71
  Bottom 0.102: v13.47,11.71 13.46,11.72 13.46,12.34 12.95,12.85 11.68,12.85 11.28,13.26 10.57,13.26 10.36,13.46 10.04,13.46 PADS.49
CLK  (via drill 0.2)
  Top 0.102: U1.L4 12.41,9.55 12.08,9.87 12.08,10.2 11.92,10.36 11.59,10.36 11.43,10.53 v11.43,10.97 | U2.6 8.13,9.4 v8.18,9.45
  Bottom 0.102: v11.43,10.97 10.16,10.97 9.7,10.52 9.04,10.52 8.18,9.65 v8.18,9.45
CS  (via drill 0.2)
  Top 0.102: U1.L3 12.41,10.2 12.09,10.52 12.09,11.61 v12.04,11.66 | U2.1 9.4,11.53 v9.6,11.73
  Bottom 0.102: v12.04,11.66 11.7,12 11.38,12 11.11,11.73 v9.6,11.73
D0  (via drill 0.2)
  Top 0.102: U1.P3 10.13,10.04 9.6,10.57 v9.6,10.92 | U2.5 7.63,9.41 v7.67,9.45
  Bottom 0.102: v9.6,10.92 9.4,10.72 8.94,10.72 v7.67,9.45
D1
  Top 0.102: U1.N4 10.94,9.39 10.6,9.73 10.13,9.73 8.99,10.87 8.74,10.87 8.63,10.98 U2.2
D1+  (via drill 0.2)
  Top 0.102: v12.08,7.11 U1.L8
  Bottom 0.102: PADS.65 1.56,6.75 3.81,8.99 6.3,8.99 7.11,8.18 9.14,8.18 9.96,7.37 11.18,7.37 11.28,7.47 11.58,7.47 11.94,7.11 v12.08,7.11 14.58,7.11 15.09,7.62 15.6,7.62 15.75,7.47 18.24,7.47 19.05,8.28 19.71,8.28 21.69,10.26 21.69,10.67 22.38,11.35 23.38,11.35 23.63,11.61 24.23,11.61 24.49,11.35 24.49,10.44 H1.6
D1-  (via drill 0.2)
  Top 0.102: v11.43,7.11 U1.M8
  Bottom 0.102: PADS.66 0.85,5.75 3.89,8.79 6.2,8.79 7.01,7.98 9.04,7.98 9.86,7.16 11.38,7.16 v11.43,7.11 11.53,7.11 11.89,6.76 12.24,6.76 12.39,6.91 14.68,6.91 15.19,7.42 15.49,7.42 15.65,7.26 18.34,7.26 19.15,8.08 19.81,8.08 21.89,10.16 21.89,10.57 22.48,11.15 23.77,11.15 H1.8
D2
  Top 0.102: U1.P4 10.36,9.48 10.08,9.48 8.89,10.67 8.33,10.67 8.13,10.87 U2.3
D2+  (via drill 0.2)
  Top 0.102: U1.P7 10.38,7.37 9.86,7.37 9.35,7.87 7.16,7.87 7.06,7.77 4.78,7.77 4.27,8.28 2.9,8.28 2.59,8.59 2.08,8.59 v1.83,8.84
  Bottom 0.102: PADS.62 0.87,9.75 1.78,8.84 v1.83,8.84
D2-  (via drill 0.2)
  Top 0.102: U1.N7 11.1,7.44 10.77,7.11 9.8,7.11 9.25,7.67 7.26,7.67 7.16,7.57 4.67,7.57 4.17,8.08 2.79,8.08 2.49,8.38 1.88,8.38 v1.83,8.33
  Bottom 0.102: v1.83,8.33 1.41,8.75 PADS.63
D3
  Top 0.102: U1.P5 10.39,8.67 9.89,8.67 9.65,8.91 9.65,9.6 9.45,9.8 9.14,9.8 8.63,9.29 U2.7
GND  (via drill 0.2)
  other vias: 16.63,11.66 18.62,5.16 19.08,2.54 17.28,2.56 14.98,2.18 10.13,9.02 8.48,4.88 7.47,6.15 4.93,8.43 3,9.86 4.72,12.04 7.16,12.29 7.98,10.52 1.93,12.14 1.93,9.86 4.98,12.95 7.16,9.6 9.65,2.39 12.73,4.52 24.23,9.14 25.53,12.12 23.11,9.25 3.3,4.72 21.34,8.59 22.2,6.35 24.54,6.55 24.23,5.33 25.55,5.33 25.55,6.6 25.55,4.06 13.38,4.52 14.03,4.52 14.68,4.52 15.33,4.52 14.68,3.87 14.03,3.87 12.73,3.87 12.73,5.12 12.08,5.12 12.08,5.85 12.11,6.39 11.43,6.47 12.73,6.45 13.38,6.45 14.68,6.51 15.28,6.52 13.38,7.77 14.03,7.77 12.73,9.02 10.78,9.02 12.73,10.37 12.73,9.75 17.37,2.03 17.26,0.44 18.25,0.43 19.25,0.44 20.26,0.43 21.25,0.43 1.98,3.81 2.64,6.91 4.01,6.81 4.01,7.67 1.93,5.23 0.43,5.26 3.15,8.94 2.24,7.98 1.82,13.14 2.79,12.14 4.27,13.21 6.15,12.29 7.89,12.22 6.55,11.13 0.44,8.24 0.44,7.25 10.26,12.4 11.02,12.19 15.67,12.09 16.51,12.29 17.63,12.34 19.61,9.35 17.98,2.03 23.18,1.3 23.3,2.06 24.69,2.84 25.55,2.79 25.5,0.51 25.5,14.02 23.47,13.97 23.22,13.21 20.26,14.06 19.25,14.06 18.25,14.06 16.26,14.06 25.55,7.87 25.55,9.14 25.55,10.41 24.92,11.76 19.71,11.34 15.25,14.05 14.25,14.06 12.26,14.06 7.16,11.48 1.37,7.21 1.22,3.2 4.01,2.44 3,1.47 2.69,2.34 0.43,6.25 0.43,9.25 0.43,10.25 0.44,12.24 4.25,14.06 5.25,14.06 6.25,14.06 7.25,14.06 8.24,14.06 9.25,14.06 10.25,14.06 11.25,14.06 1.27,8.33 3.81,12.14 7.16,10.57 0.43,4.25 2.25,0.43 3.25,0.43 4.25,0.43 5.26,0.43 6.25,0.44 7.25,0.44 8.26,0.44 9.25,0.44 13.25,0.44 14.25,0.44 15.25,0.44 16.26,0.43 5.28,2.24 0.44,11.25 24.49,7.72 3.76,9.6 1.93,2.84 10.25,0.44 13.25,14.06 20.88,5.79 21.03,11.18 19.91,10.11 21.79,5.84
  pour Bottom: 0,14.5 26,14.5 26,0 0,0
  pour Top: 0,14.5 26,14.5 26,0 0,0
N$1
  Top 0.102: X1.3 6.73,4.19 7.21,3.71 8.53,3.71 8.98,4.16 C11.2 9.4,4.22 10.02,4.84 U1.P11
N$2
  Top 0.102: U1.N11 10.88,4.84 10.52,4.47 9.96,4.47 9.45,3.96 9.45,3.71 9.25,3.5 8.43,3.5 7.98,3.06 C8.2 | C8.2 7.98,2.95 7.42,2.39 5.89,2.39 5.26,3.02 X1.1 | C8.2 R1.2
N$3
  Top 0.102: U1.N9 10.74,6.5 9.75,6.5 9.49,6.76 C14.2 8.98,6.82 8.53,7.26 7.46,7.26 6.69,6.5 X2.2
N$4
  Top 0.102: U1.P9 10.35,6.25 9.86,6.25 9.75,6.15 8.53,6.15 7.98,5.6 C12.2 7.32,5.54 7.07,5.28 5.69,5.28 5.19,5.78 X2.1
N$5
  Top 0.102: D1.A R3.1
N$6
  Top 0.102: U1.N6 U1.P6 9.97,8.09 9.86,7.98 9.55,7.98 9.45,8.08 7.06,8.08 6.96,7.98 4.88,7.98 4.37,8.48 3.02,8.48 2.45,9.05 Q1.2 | Q1.2 2.45,10.25 U3.6 2.26,10.27 1.93,10.6 1.93,11.12 1.26,11.79 C21.2 | Q1.2 1.68,9.2 C18.2
N$7
  Top 0.102: U1.K7 13.06,7.6 12.73,7.92 12.73,8.25 12.57,8.41 12.24,8.41 12.08,8.57 12.08,9.55 11.92,9.71 11.59,9.71 11.43,9.87 11.43,10.2 11.27,10.36 10.94,10.36 10.78,10.52 10.78,10.85 10.63,11 10.38,11 10.16,11.23 10.16,11.99 9.8,12.34 8.94,12.34 8.64,12.65 8.64,13.51 8.48,13.66 2.65,13.66 2.4,13.41 R4.1 2.4,11.61 U3.4
N$8
  Top 0.102: U1.K8 12.73,7.11 12.73,7.6 12.57,7.76 12.24,7.76 12.08,7.92 12.08,8.25 11.92,8.41 11.59,8.41 11.43,8.57 11.43,9.55 11.27,9.71 10.94,9.71 10.78,9.87 10.78,10.2 10.59,10.39 10.23,10.39 9.96,10.67 9.96,11.89 9.7,12.14 8.84,12.14 C25.2 7.83,12.85 C22.2 D2.4
N$10  (via drill 0.2)
  Top 0.102: U1.M2 11.79,10.72 11.79,11.3 U1.M1 11.53,11.56 v11.53,11.65 | L3.2 20.42,13.01 19.99,12.57 v19.75,12.57
  Bottom 0.102: v11.53,11.65 11.53,11.63 11.89,11.28 12.34,11.28 13.7,9.92 13.7,9.56 14.43,8.84 15.65,8.84 19.1,12.29 19.47,12.29 v19.75,12.57
N$11
  Top 0.102: U1.L2 U1.L1 12.41,12.87 C26.2 13.16,13.01 13.51,13.36 14.43,13.36 14.88,12.91 C23.2 14.88,12.89 15.34,13.36 16.56,13.36 17.01,12.91 C24.2 L2.2
N$12  (via drill 0.2)
  Top 0.102: U1.J9 13.87,6.3 14.19,6.3 U1.H9 U1.G9 U1.F9 U1.F8 15.62,6.79 v15.34,7.06 15.66,7.37 U1.F7 U1.F6 U1.G6 U1.H6 U1.J5 | L3.1 22.71,12.29 22.71,10.87 22.51,10.68 C20.2 C19.2 20.42,9.51 C17.2 C15.2 20.48,7.72 v19.81,7.72
  Bottom 0.102: v15.34,7.06 18.44,7.06 19.25,7.87 19.66,7.87 v19.81,7.72
N$14  (via drill 0.2)
  Top 0.102: U1.M9 11.44,5.82 10.15,5.82 v10.08,5.89 | D2.6 5.65,11.17 5.84,10.97 6.2,10.97 6.65,10.52 D2.3 C16.2 6.65,8.93 v6.1,8.38
  Bottom 0.102: v10.08,5.89 9.7,6.27 9.7,7.01 8.94,7.77 6.91,7.77 6.3,8.38 v6.1,8.38
N$15
  Top 0.102: Q1.3 3.4,6.6 3.82,6.19 L1.2
N$16
  Top 0.102: F1.2 1.94,5.99 2.23,5.69 3.3,5.69 3.8,5.19 L1.1
N$32
  Top 0.102: U1.P8 9.82,6.79 9.14,7.47 7.37,7.47 7.26,7.37 4.62,7.37 4.37,7.11 4.37,2.13 4.72,1.79 C5.2 C6.2
N$33  (via drill 0.2)
  Top 0.102: U1.P10 9.7,5.49 v9.6,5.59 | C13.2 2.95,4.88 2.95,4.57 3.25,4.27 v3.25,3.56 3.3,3.56 3.8,3.06 C10.2
  Bottom 0.102: v9.6,5.59 9.5,5.49 8.13,5.49 7.77,5.13 4.47,5.13 4.17,4.83 4.17,4.27 3.45,3.56 v3.25,3.56
N$34  (via drill 0.2)
  Top 0.102: U1.M10 11.44,5.16 10.09,5.16 10.01,5.08 v9.55,5.08 | v3.25,2.64 3.11,2.64 2.69,3.06 C9.2
  Bottom 0.102: v9.55,5.08 9.35,5.28 8.23,5.28 7.87,4.93 4.57,4.93 4.37,4.72 4.37,4.17 3.25,3.05 v3.25,2.64
ONOFF  (via drill 0.2)
  Top 0.102: U1.M6 11.59,8.09 11.27,8.41 9.78,8.41 v9.7,8.33
  Bottom 0.102: PADS.59 2.69,12.75 6.25,9.19 6.4,9.19 7.21,8.38 9.65,8.38 v9.7,8.33
PTA1/DE  (via drill 0.2)
  Top 0.102: U1.F3 15.66,10.2 15.98,10.52 v15.98,11.63 | v17.25,13.66 20.98,13.66 21.18,13.87 22.61,13.87 22.86,13.61 22.86,12.74 23.66,11.94 23.66,11.63 23.32,11.29 23.32,10.31 23.84,9.79 H1.9
  Bottom 0.102: v15.98,11.63 16.05,11.71 16.05,12.95 16.75,13.65 PADS.42 16.84,13.66 v17.25,13.66
PTA3/TRSTB  (via drill 0.2)
  Top 0.102: U1.G10 15.01,5.45 v14.68,5.12 | U1.K3 13.06,10.02 v13.34,9.74 | v22.35,5.23 22.5,5.08 22.5,4.47 22.09,4.06 R2.2 | v19.81,12.06 20.09,12.34 20.98,12.34 21.13,12.5 21.13,13.51 21.29,13.66 22.5,13.66 22.66,13.51 22.66,12.65 22.91,12.39 22.91,10.78 22.48,10.35 v22.48,10.25
  Bottom 0.102: v14.68,5.12 14.84,5.28 17.53,5.28 17.93,5.69 19.51,5.69 20.12,5.08 22,5.08 22.15,5.23 v22.35,5.23 | v13.34,9.74 13.34,9.62 14.33,8.64 15.75,8.64 19.2,12.09 19.79,12.09 v19.81,12.06 | v22.48,10.25 23.04,10.25 23.21,10.41 24.13,10.41 24.59,9.96 24.59,8.26 25.14,7.71 H1.4 24.68,7.25 24.03,6.6 23.62,6.6 23.27,6.25 23.27,5.49 23.01,5.23 v22.35,5.23 | v22.35,5.23 22.35,5.06 22.66,4.75 PADS.27
PTA4  (via drill 0.2)
  Top 0.102: U1.F11 15.82,4.84 16.14,4.51 16.47,4.51 16.63,4.35 16.63,4.02 16.79,3.86 17.12,3.86 17.28,3.7 17.28,3.37 17.44,3.21 17.77,3.21 17.93,3.05 v17.93,2.59 | H1.11 23.76,7.25 23.11,6.6 23.11,4.17 21.39,2.44 v21.34,2.44
  Bottom 0.102: PADS.20 19.75,0.82 17.98,2.59 v17.93,2.59 17.93,3.05 18.19,3.3 19,3.3 19.36,2.95 19.36,2.85 19.56,2.64 19.86,2.64 20.02,2.79 21.03,2.79 21.34,2.49 v21.34,2.44
PTA5/TMS/SWDIO  (via drill 0.2)
  Top 0.102: U1.E14 16.42,2.77 v16.42,2.12
  Bottom 0.102: PADS.18 17.75,0.84 16.47,2.12 v16.42,2.12 16.42,2.81 17.32,3.71 19.2,3.71 19.36,3.56 19.68,3.56 19.99,3.86 21.34,3.86 22.25,2.95 22.25,2.54 22.4,2.39 23.1,2.39 23.56,2.85 24.13,2.85 24.49,3.2 24.49,4.06 H1.2
PTA6/TDO  (via drill 0.2)
  Top 0.102: U1.G13 14.64,3.17 14.64,2.58 v14.59,2.53
  Bottom 0.102: PADS.14 13.75,1.35 14.44,2.04 14.44,2.38 v14.59,2.53 14.76,2.53 15.17,2.95 15.65,2.95 17.02,4.32 18.8,4.32 18.9,4.42 18.9,4.88 19.2,5.18 19.71,5.18 20.02,4.88 21.84,4.88 22.35,4.37 23.14,4.37 23.27,4.5 23.27,5.08 23.52,5.33 23.52,5.63 H1.12
PTA7/TDI  (via drill 0.2)
  Top 0.102: U1.F14 15.71,2.83 v15.71,2.13
  Bottom 0.102: PADS.16 15.75,2.1 v15.71,2.13 15.71,2.71 17.12,4.12 18.9,4.12 19.1,4.32 19.1,4.78 19.3,4.98 19.61,4.98 19.91,4.67 21.74,4.67 22.25,4.17 23.32,4.17 H1.13
PTB0/TCK/SWCLK  (via drill 0.2)
  Top 0.102: U1.F12 15.66,4.02 15.98,3.7 15.98,3.37 16.14,3.21 16.47,3.21 16.68,3.01 16.68,2.59 v16.78,2.49 | v21.13,3.4 21.23,3.3 21.64,3.3 22.71,4.37 22.71,6.81 23.01,7.11 23.01,7.52 23.86,8.37 H1.10
  Bottom 0.102: PADS.19 18.45,0.75 17.98,1.22 17.68,1.22 16.78,2.12 v16.78,2.49 16.78,2.86 17.42,3.5 19.1,3.5 19.25,3.35 19.86,3.35 20.02,3.2 20.93,3.2 v21.13,3.4
PTB1  (via drill 0.2)
  Top 0.102: U1.M7 11.43,7.76 10.15,7.76 v10.11,7.72
  Bottom 0.102: PADS.52 6.75,13.65 5.13,12.03 5.13,10.97 5.13,10.62 6.35,9.4 6.5,9.4 7.32,8.59 9.45,8.59 9.55,8.69 9.85,8.69 10.06,8.48 10.06,7.77 v10.11,7.72 10.26,7.57 11.07,7.57 11.18,7.67 11.68,7.67 11.89,7.47 12.24,7.47 12.39,7.32 14.48,7.32 14.99,7.82 15.7,7.82 15.85,7.67 18.14,7.67 18.95,8.48 19.61,8.48 21.49,10.36 21.49,10.77 22.25,11.53 22.25,11.99 22.4,12.14 23.46,12.14 23.76,11.84 24.33,11.84 25.11,11.06 H1.7
PTB4  (via drill 0.2)
  Top 0.102: U1.D10 17.12,5.49 17.44,5.16 17.77,5.16 17.93,5 17.93,4.67 18.09,4.51 18.42,4.51 18.58,4.35 18.58,4.08 18.8,3.86 19.05,3.86 19.25,3.66 19.25,3.3 19.56,3 v19.71,3 | v21.39,2.95 21.54,3.1 21.74,3.1 22.91,4.27 22.91,6.71 23.22,7.01 23.22,7.42 23.67,7.87 24.03,7.87 24.68,8.52 H1.5
  Bottom 0.102: v19.71,3 21.34,3 v21.39,2.95 21.49,2.95 21.69,2.74 21.69,2.44 22.38,1.75 PADS.24
PTB5/MOD  (via drill 0.2)
  Top 0.102: U1.F13 15.66,3.32 16.02,2.96 16.02,2.56 v16.07,2.52
  Bottom 0.102: PADS.17 16.42,0.75 15.95,1.22 15.95,1.83 16.07,1.94 v16.07,2.52 16.07,2.76 17.22,3.91 19,3.91 19.36,4.27 21.54,4.27 22.5,3.3 23.06,3.3 23.27,3.5 23.27,3.77 23.56,4.06 24.09,4.06 24.59,4.56 24.59,5.53 25.03,5.98 H1.3
VBAT  (via drill 0.2)
  Top 0.102: D2.1 5.65,9.71 5.56,9.63 v5.31,9.63
  Bottom 0.102: v5.31,9.63 5.31,9.85 3.41,11.75 PADS.60
VIN  (via drill 0.2)
  Top 0.102: F1.1 1.37,4.38 v1.37,3.71
  Bottom 0.102: PADS.70 PADS.69 PADS.68 1.33,3.75 v1.37,3.71